# EAGLE design Temp_Project (EAGLE 9.6.2)

## Sheet 1 of 3: POWER SUPPLY
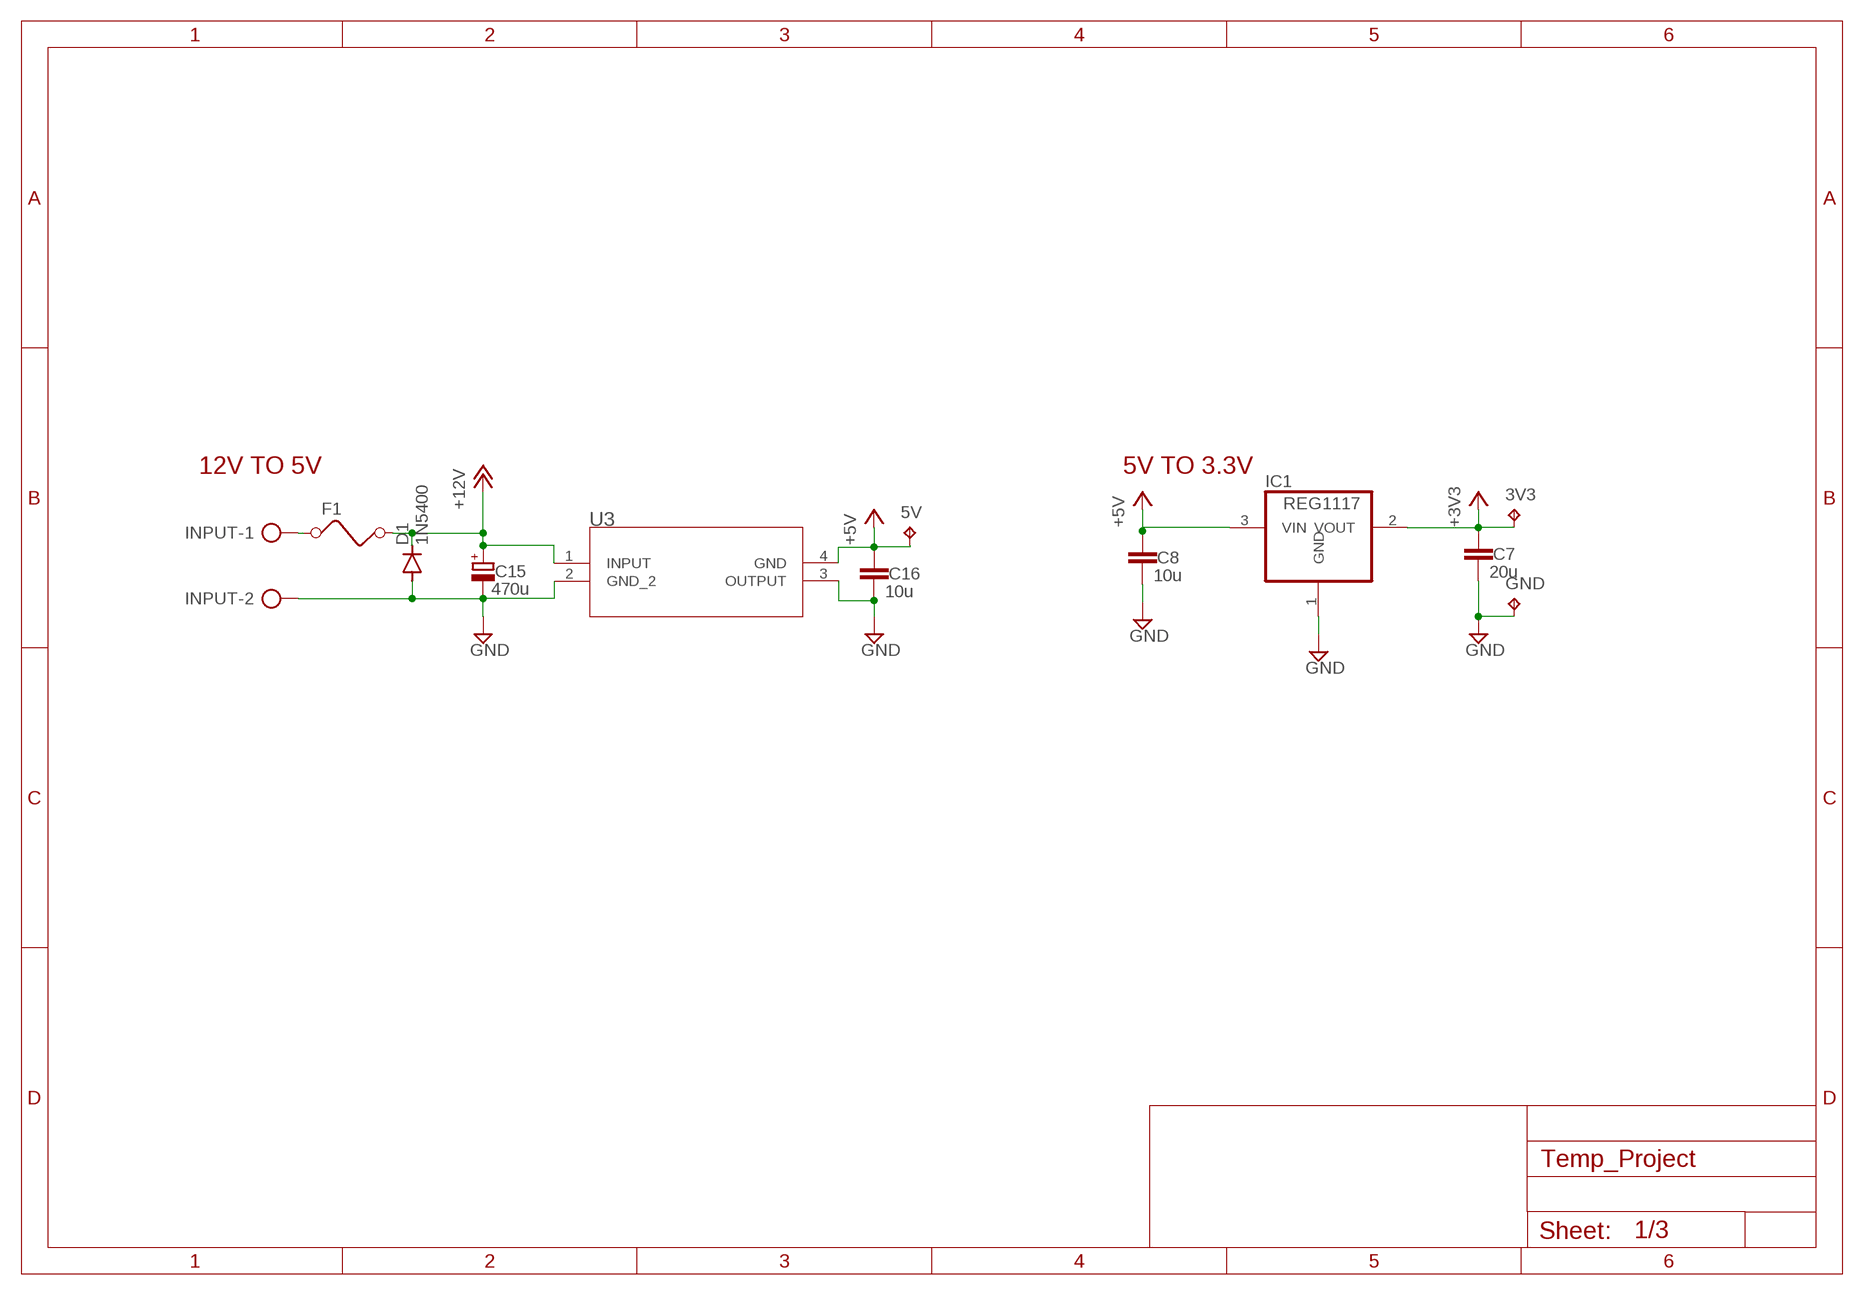
[diagram p0: schematic, sheet 1]

### Parts
3V3  TPPAD1-13  [P1-13]
5V  TPPAD1-13  [P1-13]
C7  20u  C-EUC0805  [C0805]
C8  10u  C-EUC0805  [C0805]
C15  470u  CPOL-EUE5-10.5  [E5-10,5]
C16  10u  C-EUC0805  [C0805]
D1  1N5400  [DO201-15]
F1  FUSE  [FUSE]
GND  TPPAD1-13  [P1-13]
IC1  REG1117  [SOT223]
INPUT  AK500/2-H  [AK500/2-H]
U3  LM7805MPX/NOPBDCY4_TEX  [DCY4_TEX]

### Nets
+3V3: 3V3.TP C7.1 IC1.2(VOUT) ; also sheet 2,3
+5V: 5V.TP C8.1 C16.1 IC1.3(VIN) U3.4(GND) ; also sheet 2
+12V: C15.+ D1.C F1.2 U3.1(INPUT) ; also sheet 2
GND: C7.2 C8.2 C15.- C16.2 D1.A GND.TP IC1.1(GND) INPUT.2 U3.2(GND_2) U3.3(OUTPUT) ; also sheet 2,3
N$3: F1.1 INPUT.1

### Notes on the sheet
- 12V TO 5V | 5V TO 3.3V

## Sheet 2 of 3: USER INTERFACE
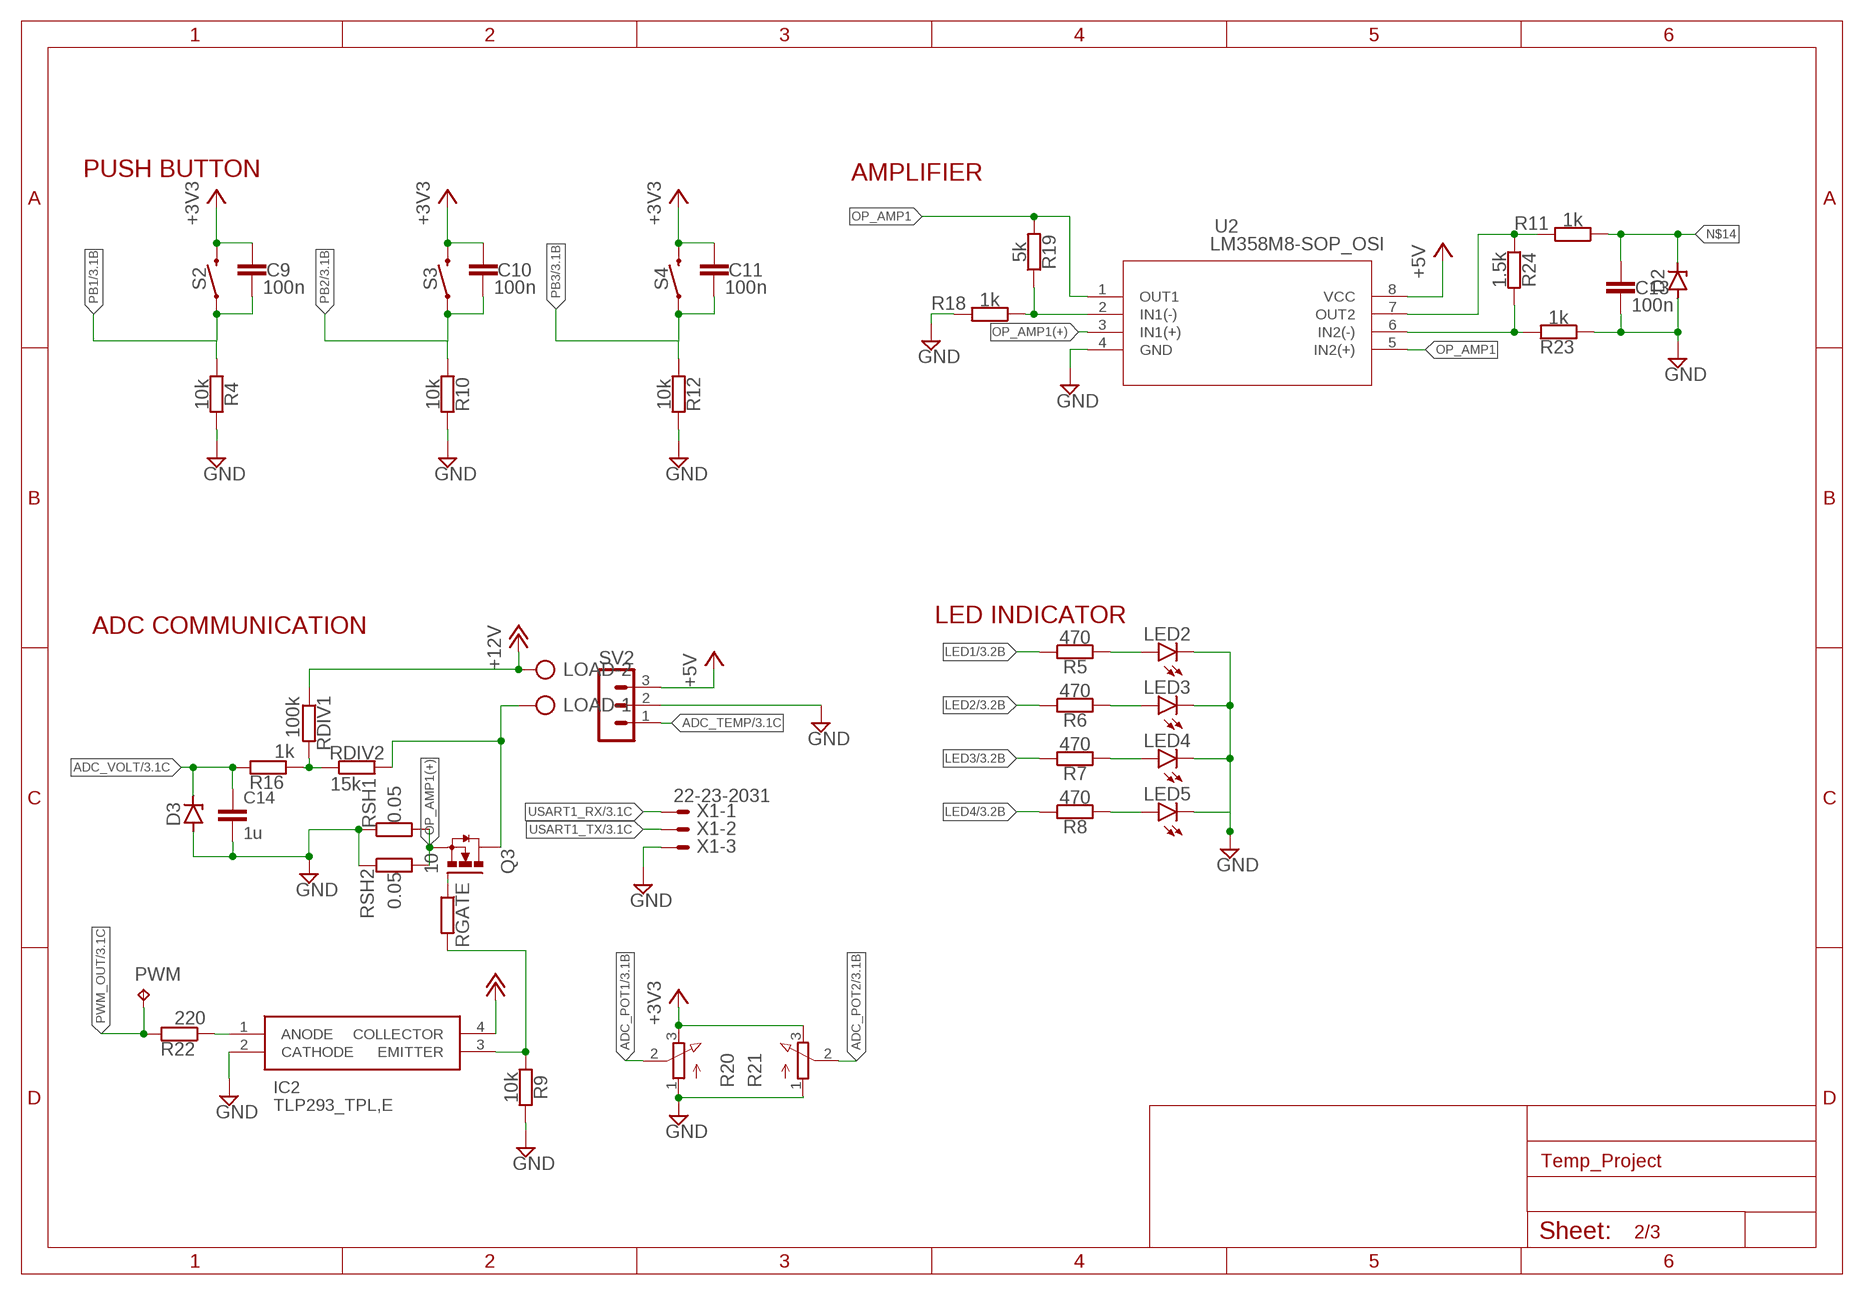
[diagram p1: schematic, sheet 2]

### Parts
C9  100n  C-EUC0805  [C0805]
C10  100n  C-EUC0805  [C0805]
C11  100n  C-EUC0805  [C0805]
C13  100n  C-EUC0805  [C0805]
C14  1u  C-EUC0805  [C0805]
D2  ZENER 3V3  ZENER-DIODESOD80C  [SOD80C]
D3  ZENER 3V3  ZENER-DIODESOD80C  [SOD80C]
IC2  TLP293_TPL,E  [SOIC127P700X220-4N]
LED2  LED3MM  [LED3MM]
LED3  LED3MM  [LED3MM]
LED4  LED3MM  [LED3MM]
LED5  LED3MM  [LED3MM]
LOAD  AK500/2-H  [AK500/2-H]
PWM  TPPAD1-13  [P1-13]
Q3  IRFZ44N  N-HEXFET-2D_SOT232-  [SOT223]
R4  10k  R-EU_R0805  [R0805]
R5  470  R-EU_R0805  [R0805]
R6  470  R-EU_R0805  [R0805]
R7  470  R-EU_R0805  [R0805]
R8  470  R-EU_R0805  [R0805]
R9  10k  R-EU_R0805  [R0805]
R10  10k  R-EU_R0805  [R0805]
R11  1k  R-EU_R0805  [R0805]
R12  10k  R-EU_R0805  [R0805]
R16  1k  R-EU_R0805  [R0805]
R18  1k  R-EU_R0805  [R0805]
R19  5k  R-EU_R0805  [R0805]
R20  3RP/1610N  [3RP/1610N]
R21  3RP/1610N  [3RP/1610N]
R22  220  R-EU_R0805  [R0805]
R23  1k  R-EU_R0805  [R0805]
R24  1.5k  R-EU_R0805  [R0805]
RDIV1  100k  R-EU_R0805  [R0805]
RDIV2  15k  R-EU_R0805  [R0805]
RGATE  10  R-EU_R0805  [R0805]
RSH1  0.05  R-EU_0617/22  [0617/22]
RSH2  0.05  R-EU_0617/22  [0617/22]
S2  MOMENTARY-SWITCH-SPST-SMD-6.0X3.5MM  [TACTILE_SWITCH_SMD_6.0X3.5MM]
S3  MOMENTARY-SWITCH-SPST-SMD-6.0X3.5MM  [TACTILE_SWITCH_SMD_6.0X3.5MM]
S4  MOMENTARY-SWITCH-SPST-SMD-6.0X3.5MM  [TACTILE_SWITCH_SMD_6.0X3.5MM]
SV2  MA03-1  [MA03-1]
U2  LM358M8-SOP_OSI  [8-SOP_OSI]
X1  22-23-2031  [22-23-2031]

### Nets
+3V3: C9.1 C10.1 C11.1 R20.3(E) R21.3(E) S2.2 S3.2 S4.2 ; also sheet 1,3
+5V: SV2.3 U2.8(VCC) ; also sheet 1
+12V: IC2.4(COLLECTOR) LOAD.2 RDIV1.1 ; also sheet 1
ADC_CUR: R11.2 R24.1 U2.7(OUT2) ; also sheet 3
ADC_POT1: R20.2(S) ; also sheet 3
ADC_POT2: R21.2(S) ; also sheet 3
ADC_TEMP: SV2.1 ; also sheet 3
ADC_VOLT: C14.1 D3.C R16.2 ; also sheet 3
GND: C13.2 C14.2 D2.A D3.A IC2.2(CATHODE) LED2.K(C) LED3.K(C) LED4.K(C) LED5.K(C) R4.1 R9.1 R10.1 R12.1 R18.2 R20.1(A) R21.1(A) R23.1 RSH1.1 RSH2.1 SV2.2 U2.4(GND) X1.3 ; also sheet 1,3
LED1: R5.1 ; also sheet 3
LED2: R6.1 ; also sheet 3
LED3: R7.1 ; also sheet 3
LED4: R8.1 ; also sheet 3
N$2: LED2.A R5.2
N$4: LED3.A R6.2
N$5: LED4.A R7.2
N$6: LED5.A R8.2
N$8: IC2.1(ANODE) R22.1
N$11: Q3.1(G) RGATE.1
N$12: LOAD.1 Q3.2(D) Q3.4(D) RDIV2.2
N$13: IC2.3(EMITTER) R9.2 RGATE.2
N$14: C13.1 D2.C R11.1
N$15: R18.1 R19.1 U2.2(IN1(-))
N$16: R16.1 RDIV1.2 RDIV2.1
N$17: R23.2 R24.2 U2.6(IN2(-))
OP_AMP1: R19.2 U2.1(OUT1) U2.5(IN2(+))
OP_AMP1(+): Q3.3(S) RSH1.2 RSH2.2 U2.3(IN1(+))
PB1: C9.2 R4.2 S2.1 ; also sheet 3
PB2: C10.2 R10.2 S3.1 ; also sheet 3
PB3: C11.2 R12.2 S4.1 ; also sheet 3
PWM_OUT: PWM.TP R22.2 ; also sheet 3
USART1_RX: X1.1 ; also sheet 3
USART1_TX: X1.2 ; also sheet 3

### Notes on the sheet
- PUSH BUTTON | AMPLIFIER
- LED INDICATOR
- ADC COMMUNICATION

## Sheet 3 of 3: MICROCONTROLLER
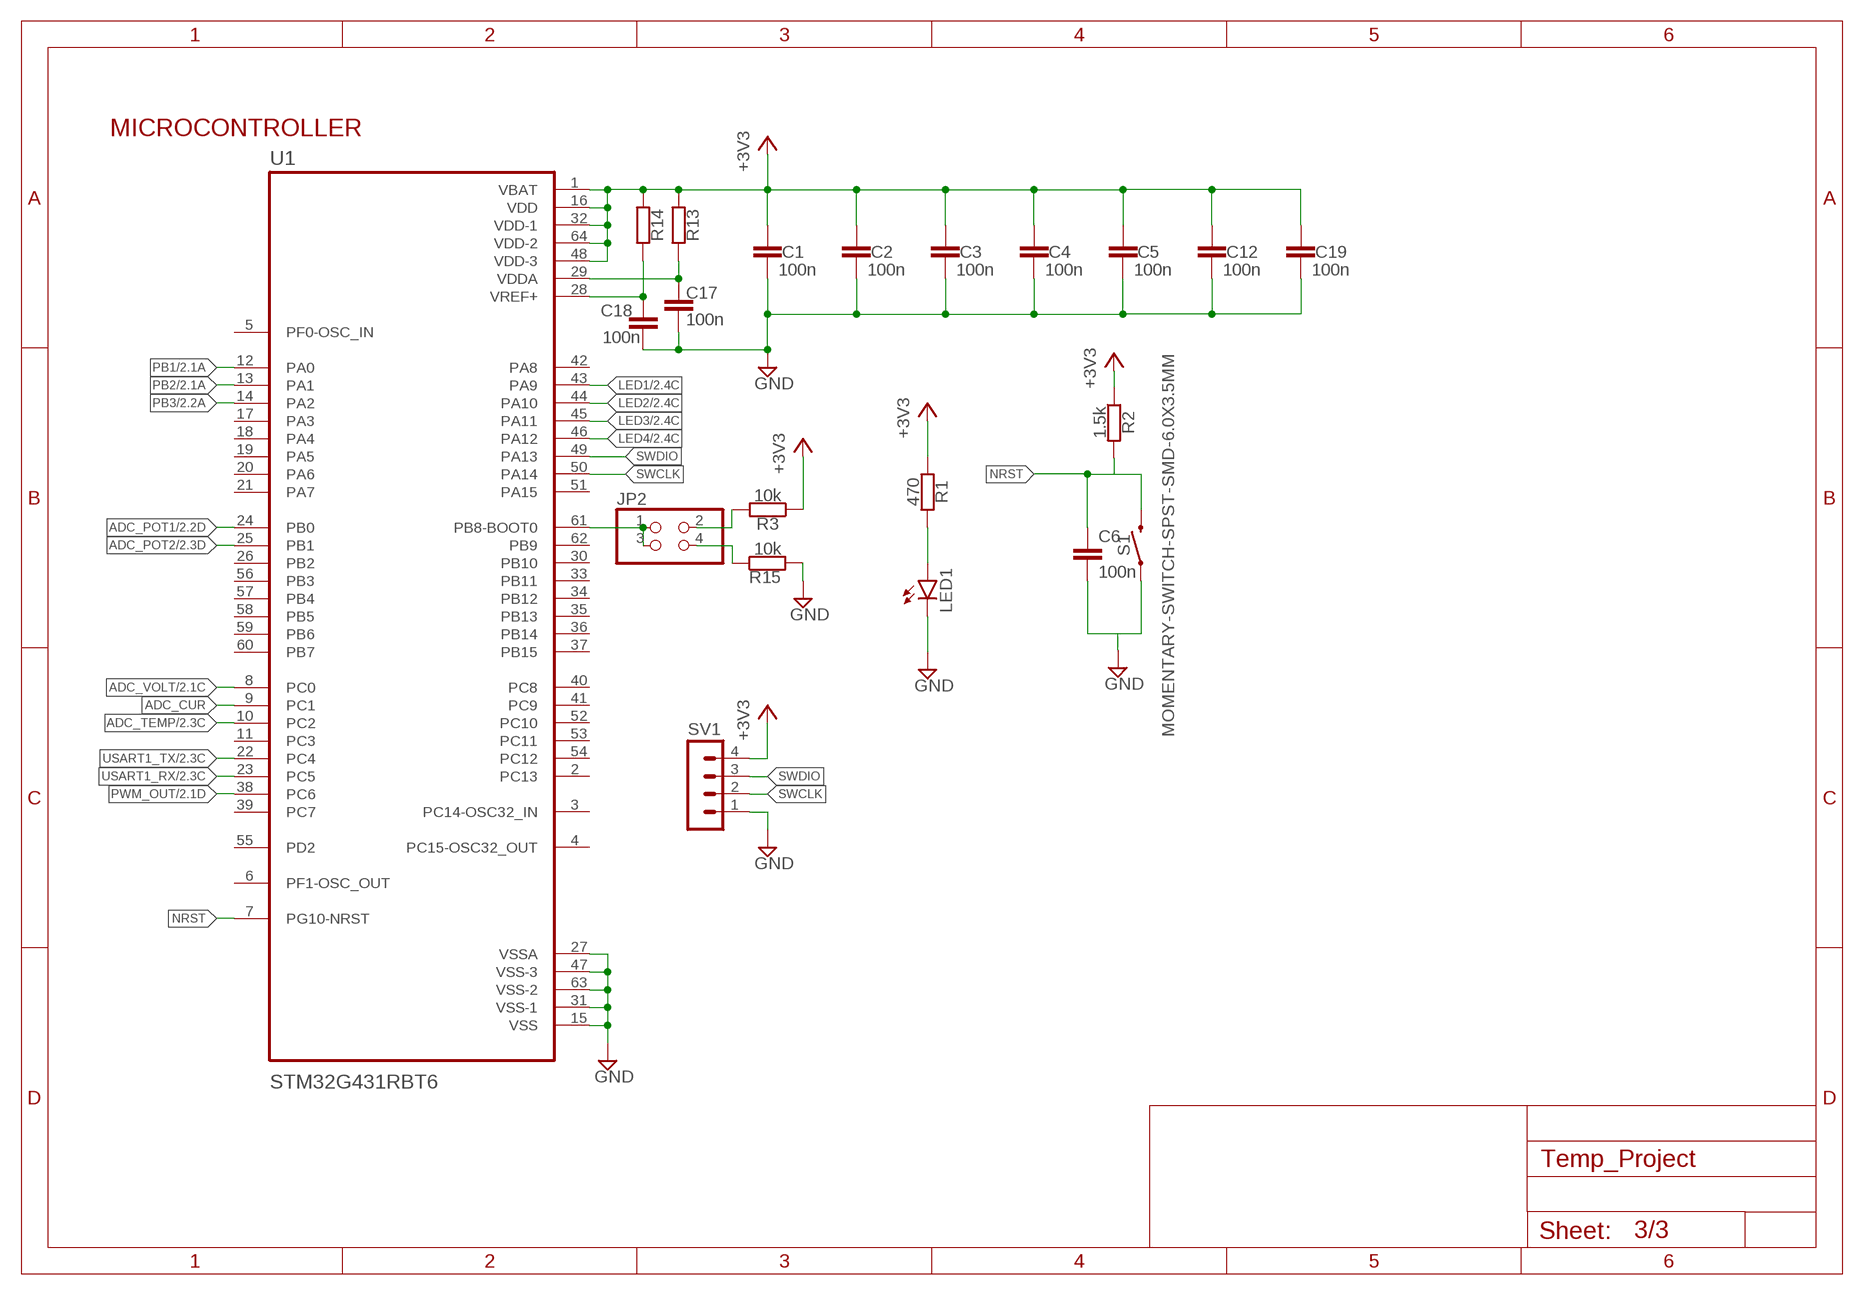
[diagram p2: schematic, sheet 3]

### Parts
C1  100n  C-EUC0805  [C0805]
C2  100n  C-EUC0805  [C0805]
C3  100n  C-EUC0805  [C0805]
C4  100n  C-EUC0805  [C0805]
C5  100n  C-EUC0805  [C0805]
C6  100n  C-EUC0805  [C0805]
C12  100n  C-EUC0805  [C0805]
C17  100n  C-EUC0805  [C0805]
C18  100n  C-EUC0805  [C0805]
C19  100n  C-EUC0805  [C0805]
JP2  PINHD-2X2  [2X02]
LED1  LEDCHIPLED_0805  [CHIPLED_0805]
R1  470  R-EU_R0805  [R0805]
R2  1.5k  R-EU_R0805  [R0805]
R3  10k  R-EU_R0805  [R0805]
R13  R-EU_R0603  [R0603]
R14  R-EU_R0603  [R0603]
R15  10k  R-EU_R0805  [R0805]
S1  MOMENTARY-SWITCH-SPST-SMD-6.0X3.5MM  [TACTILE_SWITCH_SMD_6.0X3.5MM]
SV1  MA04-1  [MA04-1]
U1  STM32G431RBT6  [QFP50P1200X1200X160-64N]

### Nets
+3V3: C1.1 C2.1 C3.1 C4.1 C5.1 C12.1 C19.1 R1.1 R2.1 R3.1 R13.2 R14.2 SV1.4 U1.1(VBAT) U1.16(VDD) U1.32(VDD-1) U1.48(VDD-3) U1.64(VDD-2) ; also sheet 1,2
ADC_CUR: U1.9(PC1) ; also sheet 2
ADC_POT1: U1.24(PB0) ; also sheet 2
ADC_POT2: U1.25(PB1) ; also sheet 2
ADC_TEMP: U1.10(PC2) ; also sheet 2
ADC_VOLT: U1.8(PC0) ; also sheet 2
GND: C1.2 C2.2 C3.2 C4.2 C5.2 C6.2 C12.2 C17.2 C18.2 C19.2 LED1.C R15.2 S1.1 SV1.1 U1.15(VSS) U1.27(VSSA) U1.31(VSS-1) U1.47(VSS-3) U1.63(VSS-2) ; also sheet 1,2
LED1: U1.43(PA9) ; also sheet 2
LED2: U1.44(PA10) ; also sheet 2
LED3: U1.45(PA11) ; also sheet 2
LED4: U1.46(PA12) ; also sheet 2
N$1: LED1.A R1.2
N$7: JP2.1 JP2.3 U1.61(PB8-BOOT0)
N$9: JP2.2 R3.2
N$10: JP2.4 R15.1
N$19: C17.1 R13.1 U1.29(VDDA)
N$20: C18.1 R14.1 U1.28(VREF+)
NRST: C6.1 R2.2 S1.2 U1.7(PG10-NRST)
PB1: U1.12(PA0) ; also sheet 2
PB2: U1.13(PA1) ; also sheet 2
PB3: U1.14(PA2) ; also sheet 2
PWM_OUT: U1.38(PC6) ; also sheet 2
SWCLK: SV1.2 U1.50(PA14)
SWDIO: SV1.3 U1.49(PA13)
USART1_RX: U1.23(PC5) ; also sheet 2
USART1_TX: U1.22(PC4) ; also sheet 2
Unconnected: U1.2(PC13) U1.3(PC14-OSC32_IN) U1.4(PC15-OSC32_OUT) U1.5(PF0-OSC_IN) U1.6(PF1-OSC_OUT) U1.11(PC3) U1.17(PA3) U1.18(PA4) U1.19(PA5) U1.20(PA6) U1.21(PA7) U1.26(PB2) U1.30(PB10) U1.33(PB11) U1.34(PB12) U1.35(PB13) U1.36(PB14) U1.37(PB15) U1.39(PC7) U1.40(PC8) U1.41(PC9) U1.42(PA8) U1.51(PA15) U1.52(PC10) U1.53(PC11) U1.54(PC12) U1.55(PD2) U1.56(PB3) U1.57(PB4) U1.58(PB5) U1.59(PB6) U1.60(PB7) U1.62(PB9)

### Notes on the sheet
- MICROCONTROLLER

## Library data of the parts
3V3 5V GND PWM = testpad:TP: Test pad
C1-C14 C16-C19 = rcl:C-EU: CAPACITOR, European symbol; SPICEPREFIX: C
C15 = rcl:CPOL-EU: POLARIZED CAPACITOR, European symbol; SPICEPREFIX: C
D1 = diode:1N5400: DIODE standard rectifier, 3 A, 50 V (Motorola)
D2 D3 = diode:ZENER-DIODE: Z-Diode
F1 = special:FUSE: FUSE 5 x 20 mm
IC1 = burr-brown:REG1117: 800mA and 1A Low Dropout (LDO) Positive Regulator 1.8V, 2.5V, 2.85V, 3.3V, 5V, and Adj; MPN: REG1117; OC_FARNELL: 1097566; OC_NEWARK: 14P6981
IC2 = TLP293_TPL_E:TLP293_TPL,E: Transistor Output Optocouplers 50mA Photocoupler 80V 3750Vrms Source: Datasheet <http://toshiba.semicon-storage.com/info/docget.jsp?did=14419&prodName=TLP293>; DESCRIPTION: Transistor Output Optocouplers 50mA Photocoupler 80V 3750Vrms; HEIGHT: 2.2mm; MANUFACTURER_NAME: Toshiba; MANUFACTURER_PART_NUMBER: TLP293(TPL,E; MOUSER_PART_NUMBER: 757-TLP293TPLE; MOUSER_PRICE-STOCK: https://www.mouser.co.uk/ProductDetail/Toshiba/TLP293TPLE?qs=OLJpxlzHOSTvU5p2rMEOZA%3D%3D
INPUT LOAD = con-ptr500:AK500/2-H: CONNECTOR Aug. 2004 / PTR Meßtechnik: Die Bezeichnung der Serie AK505 wurde geändert. Es handelt sich hierbei um AK500 in horizontaler Ausführung.; OC_FARNELL: unknown; OC_NEWARK: unknown
JP2 = pinhead:PINHD-2X2: PIN HEADER
LED1-LED5 = led:LED: LED OSRAM: - CHIPLED LG R971, LG N971, LY N971, LG Q971, LY Q971, LO R971, LY R971 LH N974, LH R974 LS Q976, LO Q976, LY Q976 LO Q996 - Hyper CHIPLED LW Q18S LB Q993, LB Q99A, LB R99A - SideLED LS A670, LO A670, LY A670, LG A670, LP A670 LB A673, LV A673, LT A673, LW A673 LH A674 LY A675 LS A676, LA A676, LO A676, LY A676, LW A676 LS A679, LY A679, LG A679 - Hyper Micro SIDELED® LS Y876, LA Y876, LO Y876, LY Y876 LT Y87S - SmartLED LW L88C, LW L88S LB L89C, LB L89S, LG L890 LS L89K, LO L89K, LY L89K LS L896, LA L896, LO L896, LY L896 - TOPLED LS T670, LO T670, LY T670, LG T670, LP T670 LSG T670, LSP T670, LSY T670, LOP T670, LYG T670 LG T671, LOG T671, LSG T671 LB T673, LV T673, LT T673, LW T673 LH T674 LS T676, LA T676, LO T676, LY T676, LB T676, LH T676, LSB T676, LW T676 LB T67C, LV T67C, LT T67C, LS T67K, LO T67K, LY T67K, LW E67C LS E67B, LA E67B, LO E67B, LY E67B, LB E67C, LV E67C, LT E67C LW T67C LS T679, LY T679, LG T679 LS T770, LO T770, LY T770, LG T770, LP T770 LB T773, LV T773, LT T773, LW T773 LH T774 LS E675, LA E675, LY E675, LS T675 LS T776, LA T776, LO T776, LY T776, LB T776 LHGB T686 LT T68C, LB T68C - Hyper Mini TOPLED® LB M676 - Mini TOPLED Santana® LG M470 LS M47K, LO M47K, LY M47K Source: http://www.osram.convergy.de LUXEON: - LUMILED® LXK2-PW12-R00, LXK2-PW12-S00, LXK2-PW14-U00, LXK2-PW14-V00 LXK2-PM12-R00, LXK2-PM12-S00, LXK2-PM14-U00 LXK2-PE12-Q00, LXK2-PE12-R00, LXK2-PE12-S00, LXK2-PE14-T00, LXK2-PE14-U00 LXK2-PB12-K00, LXK2-PB12-L00, LXK2-PB12-M00, LXK2-PB14-N00, LXK2-PB14-P00, LXK2-PB14-Q00 LXK2-PR12-L00, LXK2-PR12-M00, LXK2-PR14-Q00, LXK2-PR14-R00 LXK2-PD12-Q00, LXK2-PD12-R00, LXK2-PD12-S00 LXK2-PH12-R00, LXK2-PH12-S00 LXK2-PL12-P00, LXK2-PL12-Q00, LXK2-PL12-R00 Source: www.luxeon.com KINGBRIGHT: KA-3528ASYC Source: www.kingbright.com
Q3 = transistor-power:N-HEXFET-2D_?-*: HEXFET® Power MOSFET 2 Drain connects http://www.irf.com/product-info/datasheets/data/irll014n.pdf
R1-R16 R18 R19 R22-R24 RDIV1 RDIV2 RGATE RSH1 RSH2 = rcl:R-EU_: RESISTOR, European symbol; SPICEPREFIX: R
R20 R21 = pot:3RP/1610N: 16mm Potentiometer one level Source: http://www.alphapotentiometers.net/html/16mm_pot_2.html
S1-S4 = SparkFun-Switches:MOMENTARY-SWITCH-SPST: Momentary Switch (Pushbutton) - SPST Normally-open (NO) SPST momentary switches (buttons, pushbuttons). Variants PTH-12MM - 12mm square, through-hole Momentary Pushbutton Switch - 12mm Square <https://www.sparkfun.com/products/9190> (COM-09190) PTH-6.0MM, PTH-6.0MM-KIT - 6.0mm square, through-hole Mini Pushbutton Switch <https://www.sparkfun.com/products/97> (COM-00097) KIT package intended for soldering kit's - only one side of pads' copper is exposed. PTH-RIGHT-ANGLE-KIT - Right-angle, through-hole Right Angle Tactile Button <https://www.sparkfun.com/products/10791> - Used on SparkFun BigTime Watch Kit <https://www.sparkfun.com/products/11734> SMD-12MM - 12mm square, surface-mount Tactile Button - SMD (12mm) <https://www.sparkfun.com/products/12993> (COM-12993) Used on SparkFun PicoBoard <https://www.sparkfun.com/products/11888> SMD-4.5MM - 4.5mm Square Trackball Switch Used on SparkFun Blackberry Trackballer Breakout <https://www.sparkfun.com/products/13169> SMD-4.6MMX2.8MM - 4.60mm x 2.80mm, surface mount Used on SparkFun Pro Micro - RP2040 <https://www.sparkfun.com/products/17717> SMD-5.2MM, SMD-5.2-REDUNDANT - 5.2mm square, surface-mount Mini Pushbutton Switch - SMD <https://www.sparkfun.com/products/8720> (COM-08720) Used on Arduino Pro Mini <https://www.sparkfun.com/products/11114> REDUNDANT package connects both switch circuits together SMD-6.0X3.5MM - 6.0 x 3.5mm, surface mount Momentary Reset Switch SMD <https://www.sparkfun.com/products/8229> (COM-08229) SMD-6.2MM-TALL - 6.2mm square, surface mount Tactile Button - SMD (6mm) <https://www.sparkfun.com/products/12992> Used on SparkFun Digital Sandbox <https://www.sparkfun.com/products/12651> SMD-RIGHT-ANGLE - Right-angle, surface mount Used on SparkFun Block for Intel® Edison - Arduino <https://www.sparkfun.com/products/13036>; PROD_ID: SWCH-14278; SF_SKU: COM-08229
SV1 = con-lstb:MA04-1: PIN HEADER; OC_FARNELL: unknown; OC_NEWARK: unknown
SV2 = con-lstb:MA03-1: PIN HEADER; OC_FARNELL: unknown; OC_NEWARK: unknown
U1 = STM32G431RBT6:STM32G431RBT6: None; MANUFACTURER: STMicroelectronics; PACKAGE: QFP50P1200X1200X160-64N
U2 = 2024-10-28_07-08-54_Library:LM358M; COPYRIGHT: Copyright (C) 2024 Ultra Librarian. All rights reserved.; MANUFACTURER_PART_NUMBER: LM358M; MFR_NAME: onsemi / Fairchild Semiconductor
U3 = LM7805:LM7805MPX/NOPB; COPYRIGHT: Copyright (C) 2024 Ultra Librarian. All rights reserved.; MANUFACTURER_PART_NUMBER: LM7805MPX/NOPB; MFR_NAME: Texas Instruments
X1 = con-molex:22-23-2031: .100" (2.54mm) Center Header - 3 Pin; MF: MOLEX; MPN: 22-23-2031; OC_FARNELL: 1462950; OC_NEWARK: 30C0862

## Board
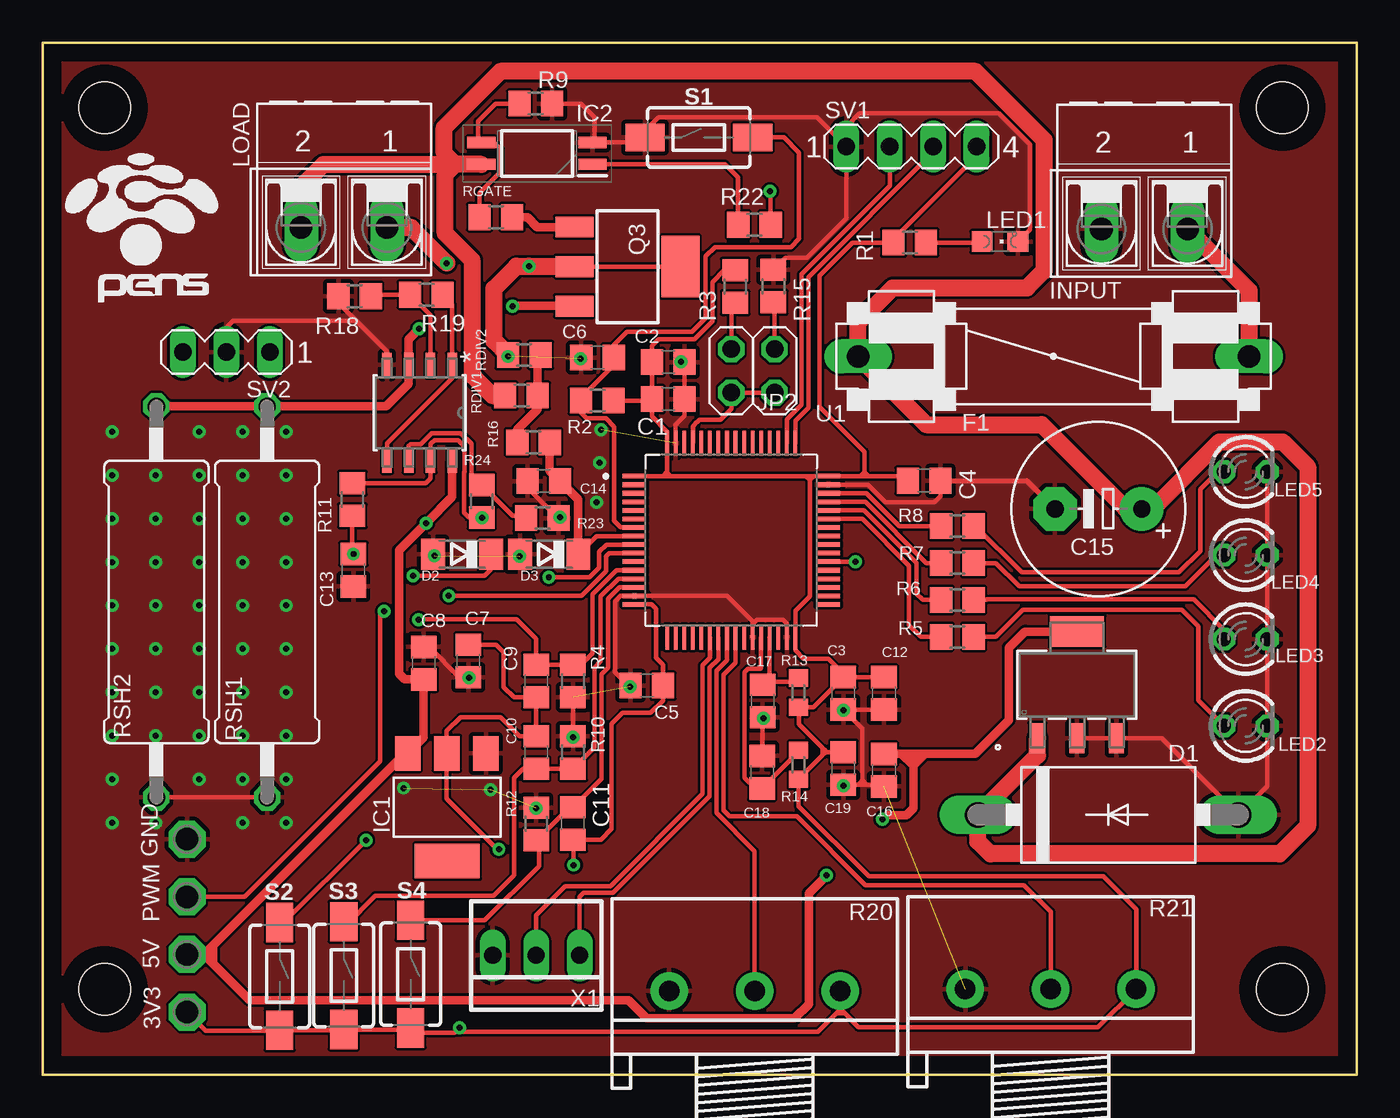
[diagram p3: board, top side]
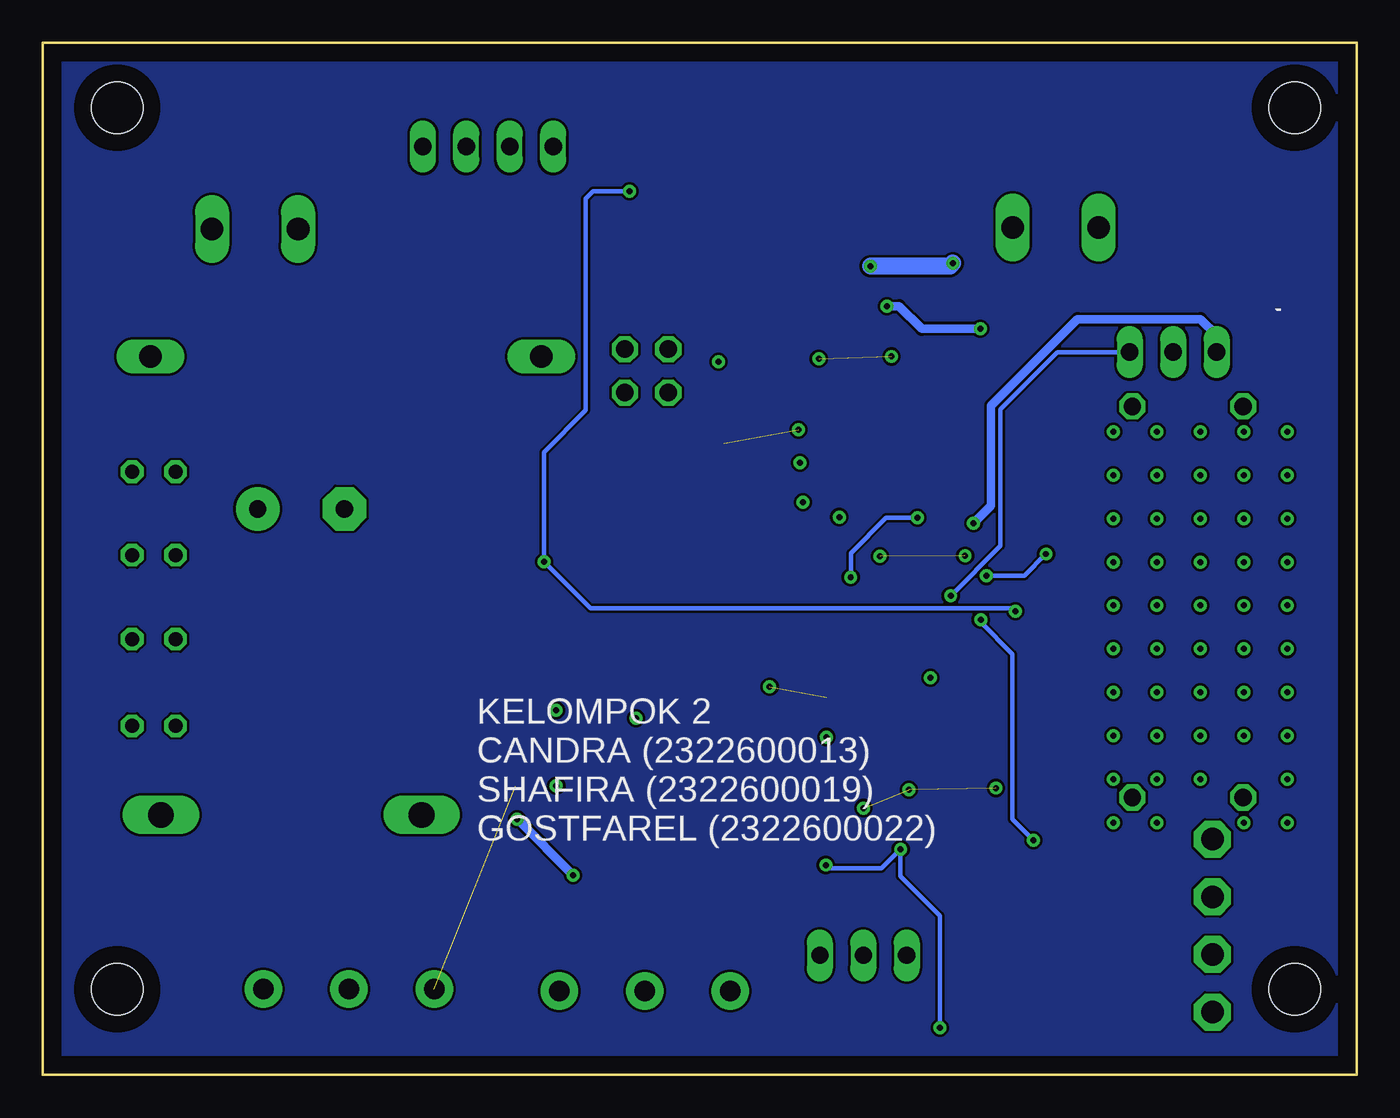
[diagram p4: board, bottom side, seen from below]

Size 76.83 x 60.33 mm. Coordinates in mm from the lower left corner, seen from the top.
Outline: 0,0 76.83,0 76.83,60.33 0,60.33 0,0
Copper layers (1*16): Top 0.035mm / dielectric 1.5mm / Bottom 0.035mm
Design rules "default *": minimum track width 6mil, minimum drill 0.35mm, track to track 6mil, track to pad 6mil, pad to pad 6mil, via to via 6mil, smd to smd 6mil, copper to edge 40mil, drill to drill 6mil, minimum pad ring 10mil, minimum via ring 8mil, stop-mask expansion 4mil, vias tented up to drill 35mil, thermal gap 10mil
Holes 3 mm at 3.62,56.53 3.62,5 72.49,5 72.49,56.53

### Footprints (pad centres in the part's own frame; a part is rotated, then mirrored left to right if it is on the bottom)
P1-13 = drill 1.321 pad 2.159 octagon: TP 0,0
C0805 = smd 1.3 x 1.5: 1 -0.95,0; 2 0.95,0
E5-10,5 = drill 1.016 pad 2.54: + -2.54,0 | drill 1.016 pad 2.54 octagon: - 2.54,0
DO201-15 = drill 1.499 long: A 7.62,0; C -7.62,0
SOD80C = smd 1.4 x 1.8: A 1.7,0; C -1.7,0
FUSE = drill 1.321 long: 1 -11.43,0; 2 11.43,0
SOT223 = smd 1.499 x 2.007: 1 -2.261,-3.15; 2 0.025,-3.15; 3 2.311,-3.15 | smd 3.81 x 2.007: 4 0,3.15
SOIC127P700X220-4N = smd 1.65 x 0.65: 1 -3.25,0.635; 2 -3.25,-0.635; 3 3.25,-0.635; 4 3.25,0.635
AK500/2-H = drill 1.321 long: 1 -2.515,0; 2 2.515,0
2X02 = drill 1.016 octagon: 1 -1.27,-1.27; 2 -1.27,1.27; 3 1.27,-1.27; 4 1.27,1.27
CHIPLED_0805 = smd 1.2 x 1.2: A 0,-1.05; C 0,1.05
LED3MM = drill 0.813 octagon: A -1.27,0; K 1.27,0
SOT223' = smd 1.219 x 2.235: 1 -2.311,-3.099; 2 0,-3.099; 3 2.311,-3.099 | smd 3.6 x 2.2: 4 0,3.099
R0805 = smd 1.3 x 1.5: 1 -0.95,0; 2 0.95,0
R0603 = smd 1 x 1.1: 1 -0.85,0; 2 0.85,0
3RP/1610N = drill 1.2 pad 2.184: 1 -5,0; 2 0,0; 3 5,0
0617/22 = drill 1.016 octagon: 1 -11.43,0; 2 11.43,0
TACTILE_SWITCH_SMD_6.0X3.5MM = smd 2.3 x 1.6: 1 -3.15,0; 2 3.15,0
MA04-1 = drill 1.016 long: 1 -3.81,0; 2 -1.27,0; 3 1.27,0; 4 3.81,0
MA03-1 = drill 1.016 long: 1 -2.54,0; 2 0,0; 3 2.54,0
QFP50P1200X1200X160-64N = smd 1.47 x 0.28: 1 -5.67,3.75; 2 -5.67,3.25; 3 -5.67,2.75; 4 -5.67,2.25; 5 -5.67,1.75; 6 -5.67,1.25; 7 -5.67,0.75; 8 -5.67,0.25; 9 -5.67,-0.25; 10 -5.67,-0.75; 11 -5.67,-1.25; 12 -5.67,-1.75; 13 -5.67,-2.25; 14 -5.67,-2.75; 15 -5.67,-3.25; 16 -5.67,-3.75; 33 5.67,-3.75; 34 5.67,-3.25; 35 5.67,-2.75; 36 5.67,-2.25; 37 5.67,-1.75; 38 5.67,-1.25; 39 5.67,-0.75; 40 5.67,-0.25; 41 5.67,0.25; 42 5.67,0.75; 43 5.67,1.25; 44 5.67,1.75; 45 5.67,2.25; 46 5.67,2.75; 47 5.67,3.25; 48 5.67,3.75 | smd 0.28 x 1.47: 17 -3.75,-5.67; 18 -3.25,-5.67; 19 -2.75,-5.67; 20 -2.25,-5.67; 21 -1.75,-5.67; 22 -1.25,-5.67; 23 -0.75,-5.67; 24 -0.25,-5.67; 25 0.25,-5.67; 26 0.75,-5.67; 27 1.25,-5.67; 28 1.75,-5.67; 29 2.25,-5.67; 30 2.75,-5.67; 31 3.25,-5.67; 32 3.75,-5.67; 49 3.75,5.67; 50 3.25,5.67; 51 2.75,5.67; 52 2.25,5.67; 53 1.75,5.67; 54 1.25,5.67; 55 0.75,5.67; 56 0.25,5.67; 57 -0.25,5.67; 58 -0.75,5.67; 59 -1.25,5.67; 60 -1.75,5.67; 61 -2.25,5.67; 62 -2.75,5.67; 63 -3.25,5.67; 64 -3.75,5.67
8-SOP_OSI = smd 1.422 x 0.559: 1 -2.794,1.905; 2 -2.794,0.635; 3 -2.794,-0.635; 4 -2.794,-1.905; 5 2.794,-1.905; 6 2.794,-0.635; 7 2.794,0.635; 8 2.794,1.905
DCY4_TEX = smd 0.889 x 1.765: 1 -2.311,-3.118; 2 0,-3.118; 3 2.311,-3.118 | smd 3.15 x 1.765: 4 0,3.118
22-23-2031 = drill 1 long: 1 -2.54,0; 2 0,0; 3 2.54,0

### Placement (x,y rotation side)
3V3  8.43,3.66 270 top
5V  8.43,7.03 270 top
C1  36.58,39.5 0 top
C2  36.58,41.66 0 top
C3  46.81,22.3 270 top
C4  51.54,34.73 0 top
C5  35.32,22.75 180 top
C6  32.44,41.92 180 top
C7  24.89,24.19 270 top
C8  22.28,24.06 90 top
C9  28.85,23.02 90 top
C10  28.85,18.84 270 top
C11  31,14.69 90 top
C12  49.19,22.3 270 top
C13  18.16,29.49 270 top
C14  29.29,34.7 180 top
C15  61.73,33.08 180 top
C16  49.19,17.81 270 top
C17  42.09,21.85 270 top
C18  42.06,17.69 90 top
C19  46.81,17.91 270 top
D1  62.3,15.19 0 top
D2  24.53,30.43 180 top
D3  29.61,30.43 180 top
F1  59.1,41.99 180 top
GND  8.43,13.77 270 top
IC1  23.65,15.64 180 top
IC2  28.9,53.86 180 top
INPUT  64.42,49.45 180 top
JP2  41.53,41.15 0 top
LED1  55.97,48.71 270 top
LED2  70.34,20.39 0 top
LED3  70.34,25.46 0 top
LED4  70.34,30.38 0 top
LED5  70.34,35.25 0 top
LOAD  17.62,49.52 180 top
PWM  8.43,10.4 270 top
Q3  IRFZ44N  [SOT223']  34.19,47.24 270 top
R1  50.7,48.65 0 top
R2  32.43,39.41 180 top
R3  40.5,46.07 270 top
R4  31,23.02 90 top
R5  53.48,25.59 0 top
R6  53.48,27.75 0 top
R7  53.48,29.91 0 top
R8  53.48,32.07 0 top
R9  28.83,56.77 180 top
R10  31,18.84 270 top
R11  18.1,33.63 90 top
R12  28.85,14.66 270 top
R13  44.18,22.34 270 top
R14  44.2,18.12 270 top
R15  42.72,46.1 90 top
R16  28.7,36.97 0 top
R18  18.24,45.51 180 top
R19  22.43,45.6 0 top
R20  41.63,4.9 0 top
R21  58.94,5.01 0 top
R22  41.61,49.69 0 top
R23  29.22,32.54 180 top
R24  25.67,33.53 90 top
RDIV1  27.99,39.7 0 top
RDIV2  28.16,42.07 180 top
RGATE  26.5,50.13 180 top
RSH1  13.12,27.64 90 top
RSH2  6.64,27.64 90 top
S1  38.36,54.79 0 top
S2  13.86,5.75 270 top
S3  17.6,5.8 270 top
S4  21.51,5.88 270 top
SV1  50.8,54.25 0 top
SV2  10.73,42.24 180 top
U1  40.26,31.24 0 top
U2  22.04,38.7 270 top
U3  60.47,22.79 0 top
X1  28.86,6.98 180 top

### Tracks (layer width: path | path; a pad name or v marks a point on that pad's centre or on a via)
+3V3  (via drill 0.35)
  Top 0.25: 36.48,34.99 36.26,34.99 | 36.26,34.99 U1.1 | 36.51,35.24 U1.64 36.51,37.6 35.63,38.48 C1.1 | C1.1 C2.1 35.63,42.61 36.01,42.99 38.1,42.99 39.16,44.05 39.16,46.33 39.85,47.02 R3.1 | C3.1 46.81,23.45 45.93,24.33 44.48,24.33 44.01,24.8 U1.32 44.01,27.13 44.85,27.97 44.85,34.77 | C3.1 45.06,21.49 R13.2 44.22,21.46 44.22,20.49 45.6,19.11 | 45.86,18.86 45.72,18.99 | 45.86,18.86 45.79,18.86 45.72,18.79 | 45.86,18.86 C19.1 | 45.6,18.66 R14.2 44.2,15.7 48.31,11.59 62.03,11.59 63.94,9.68 R21.3 61.71,2.78 47.7,2.78 46.89,3.59 | 45.6,18.66 45.72,18.79 | 47.81,34.99 U1.48 45.07,34.99 | 47.81,34.99 48.05,34.99 | 48.05,34.99 48.29,34.99 | 48.29,34.99 50.32,34.99 C4.1 | C3.1 C12.1 | SV1.4 54.61,53.69 49.75,48.83 R1.1 47.35,48.65 45.41,46.71 45.41,39.06 48.05,36.42 48.05,35.23 | C11.1 31.05,13.74 | 31.05,13.74 32.63,13.74 33.26,14.37 33.26,20.52 33.89,21.15 35.55,21.15 36.27,21.88 C5.1 36.27,23.96 35.85,24.38 35.85,27.25 35.61,27.49 U1.16 | 48.05,34.99 48.05,35.23 | 3V3.TP 9.52,2.58 13.84,2.58 S2.2 17.56,2.6 S3.2 21.43,2.65 | 48.05,35.23 48.29,34.99 | 48.05,35.23 47.81,34.99 | v26.67,13.19 26.61,13.14 23.62,16.13 23.63,16.14 IC1.2 23.63,20.1 24.43,20.9 26.77,20.9 27.88,19.8 C10.1 C9.1 27.55,22.07 26.96,22.66 26.96,24.69 26.51,25.14 C7.1 | v31.05,12.26 31.05,13.74 | 45.07,34.99 44.85,34.77 | 44.85,34.77 44.63,34.99 | 44.63,34.99 36.72,34.99 | 36.72,34.99 36.48,34.99 | 36.51,35.2 36.51,35.02 36.48,34.99 | 36.26,34.99 36.51,35.24 | 36.51,35.24 36.51,35.2 | 36.51,35.2 36.72,34.99 | 44.63,34.99 45.07,34.99 | 21.43,2.65 S4.2 21.78,2.46 | 46.4,3.59 45.32,2.5 24.62,2.5 v24.37,2.75 v24.37,2.74 24.09,2.46 21.78,2.46
  Top 0.25: 46.4,3.59 46.63,3.81 46.63,3.85 | 46.89,3.59 46.63,3.85 | 46.63,3.85 R20.3 | 21.78,2.46 21.61,2.46 21.43,2.65 | 46.4,3.59 46.89,3.59 | 45.72,18.79 45.72,18.99 | 45.72,18.99 45.6,19.11 | 45.6,19.11 45.6,18.66 | R2.1 35.54,39.41 C1.1
  Bottom 0.25: v31.05,12.26 30.86,12.07 27.79,12.07 v26.67,13.19 26.67,11.6 24.37,9.3 v24.37,2.75
+5V  (via drill 0.35)
  Top 0.5: v45.82,11.67 45.82,11.63 44.8,10.61 44.8,4.13 43.96,3.29 35.31,3.29 34.24,4.36 12.1,4.36 9.96,6.5 | v49.1,14.93 49.35,15.18 50.5,15.18 50.9,15.58 50.9,18.08 | 50.9,18.08 50.23,18.76 C16.1 51.05,18.76 | 51.05,18.76 51.57,18.76 | 51.57,18.76 54.53,18.76 56.49,20.71 56.49,24.96 57.44,25.91 U3.4 | U2.8 23.94,33.78 v22.4,32.24 20.83,30.67 20.83,23.45 21.17,23.11 C8.1 22.28,19.73 IC1.3 21.19,18.79 9.96,7.56 | 5V.TP 9.43,7.03 | 9.43,7.03 9.96,7.56 | 9.96,6.5 9.43,7.03 | 9.96,7.56 9.96,6.5 | 50.9,18.08 51.57,18.76 | 50.9,18.08 50.9,18.6 51.05,18.76
  Bottom 0.5: v45.82,11.67 49.08,14.93 v49.1,14.93 | v22.4,32.24 21.38,33.26 21.38,39.12 16.33,44.16 9.14,44.16 8.19,43.22 SV2.3
+12V
  Top 1: IC2.4 24.12,53.22 | 24.12,53.22 23.47,53.87 23.47,55.36 26.76,58.66 54.55,58.66 58.55,54.65 58.55,46.99 57.55,45.99 49.71,45.99 47.67,43.95 F1.2 51.66,38 58.41,38 63.33,33.08 C15.+ 64.9,33.08 68.81,36.99 72.51,36.99 73.97,35.53 73.97,14.55 72.33,12.91 55.41,12.91 54.68,13.64 D1.C 54.69,15.19 58.16,18.67 U3.1 | 24.12,53.22 23.54,52.65 23.54,49.18 25.1,47.62 25.1,40.89 26.29,39.7 RDIV1.1 | LOAD.2 15.1,51.91 16.41,53.22 24.12,53.22
ADC_CUR  (via drill 0.35)
  Top 0.25: U1.9 32.96,30.99 32.52,30.56 32.52,29.64 31.96,29.08 v29.59,29.08 | v25.7,32.55 R24.1 24.91,32.58 24.64,32.85 24.64,35.24 24.66,35.26 24.66,36.72 24.28,37.1 22.9,37.1 22.67,36.88 U2.7 22.67,34.87 22.39,34.58 R11.2
  Bottom 0.25: v29.59,29.08 29.59,30.48 27.52,32.55 v25.7,32.55
ADC_POT1
  Top 0.25: U1.24 40.01,24.23 39.4,23.62 39.4,15.3 41.63,13.07 R20.2
ADC_POT2
  Top 0.25: U1.25 40.51,24.08 39.8,23.37 39.8,15.47 40.17,15.1 44.1,15.1 48.11,11.09 57.37,11.09 58.94,9.52 R21.2
ADC_TEMP  (via drill 0.35)
  Top 0.25: U1.10 33.1,30.49 32.92,30.32 32.92,29.43 31.51,28.01 v23.74,28.01
  Bottom 0.25: v23.74,28.01 20.84,30.91 20.84,38.91 17.51,42.24 SV2.1
ADC_VOLT
  Top 0.25: D3.C 32.38,31.49 U1.8
  Top 0.5: D3.C 31.32,33.63 C14.1 29.65,35.3 R16.2
GND  (via drill 0.35)  (7 unrouted)
  Top 0.25: C17.2 42.09,18.67 C18.2 | C12.2 C3.2 47.93,20.23 47.93,17.2 | C19.2 47.72,16.95 | 47.72,16.95 47.93,16.95 | 47.93,16.95 48.18,16.95 | 48.18,16.95 49.09,16.95 C16.2 | 47.93,16.95 47.93,17.2 | 47.93,17.2 48.18,16.95 | 47.93,17.2 47.72,16.99 47.72,16.95 | R4.1 R10.1 | U1.31 43.51,26.35 43.28,26.58 41.76,26.58 41.59,26.42 | U1.27 41.51,26.33 41.59,26.42 | v34.33,22.67 33.46,23.54 33.46,27.66 33.8,27.99 U1.15 40.02,27.99 41.59,26.42 | U1.63 37.01,37.99 37.53,38.51 C1.2 C2.2 | U1.47 48.26,34.49 49.29,33.46 52.14,33.46 52.49,33.81 C4.2 | U3.2 U3.3 65.44,19.67 D1.A 71.61,16.88 LED2.K LED3.K LED4.K LED5.K | U2.4 20.13,42.26 18.32,44.08 | R9.1 31.49,56.77 32.28,55.98 32.28,54.62 IC2.2 32.17,54.51 34.93,54.51 S1.1 35.21,55.18 36,55.96 45.28,55.96 SV1.1 | R15.2 43.43,47.76 44.69,47.76 46.99,50.06 SV1.1 | C8.2 22.59,25.01 24.36,23.24 C7.2 | LED1.C 57.71,49.4 57.71,54.39 55.91,56.19 47.76,56.19 46.99,55.42 SV1.1 | SV2.2 10.73,43.68 11.14,44.08 18.32,44.08 | RSH1.1 RSH2.1 | 18.32,44.08 17.29,45.1 R18.2 | C14.2 28.34,34.32 30.12,32.54 R23.1
  Top 0.305: C4.2 57.54,34.73 C15.-
  other vias: 32.55,35.77 32.64,37.71 32.38,33.47 30.26,32.6 27.88,30.3 28.85,15.59 22.9,30.34 46.82,21.3 24.93,23.2 26.18,16.66 21.1,16.76 31,19.74 46.81,16.9 37.33,41.67 42.14,20.84 27.2,41.99 4.06,37.59 9.14,37.59 11.68,37.59 14.22,37.59 6.6,37.59 4.06,35.05 9.14,35.05 11.68,35.05 14.22,35.05 6.6,35.05 4.06,32.51 9.14,32.51 11.68,32.51 14.22,32.51 6.6,32.51 4.06,29.97 9.14,29.97 11.68,29.97 14.22,29.97 6.6,29.97 4.06,27.43 9.14,27.43 11.68,27.43 14.22,27.43 6.6,27.43 4.06,24.89 9.14,24.89 11.68,24.89 14.22,24.89 6.6,24.89 4.06,22.35 9.14,22.35 11.68,22.35 14.22,22.35 6.6,22.35 4.06,19.81 9.14,19.81 11.68,19.81 14.22,19.81 6.6,19.81 4.06,17.27 9.14,17.27 11.68,17.27 14.22,17.27 4.06,14.73 11.68,14.73 14.22,14.73 6.6,14.73 31.46,41.85
  pour Top: 0,0 76.83,0 76.83,4.45 76.83,60.33 0,60.33
GND1
  pour Bottom: 0,0 76.83,0 76.83,4.45 76.83,60.33 0,60.33
LED1
  Top 0.25: U1.43 47.92,32.49 50.66,29.75 50.66,26.29 50.65,26.28 51.34,25.59 R5.1
LED2
  Top 0.25: U1.44 48.03,32.99 51.1,29.92 51.1,28.13 51.47,27.75 R6.1
LED3
  Top 0.25: U1.45 48.1,33.49 51.68,29.91 R7.1
LED4
  Top 0.25: R8.1 50.09,32.07 48.17,33.99 U1.46
N$1
  Top 0.25: LED1.A 54.89,48.65 R1.2
N$2
  Top 0.25: R5.2 55.74,25.59 57.32,27.17 66.62,27.17 67.57,26.22 67.57,21.89 LED2.A
N$3
  Top 1: INPUT.1 70.53,45.85 F1.1
N$4
  Top 0.25: R6.2 54.46,27.78 55.21,27.78 55.22,27.78 67.3,27.78 69.07,26.02 LED3.A
N$5
  Top 0.25: R7.2 55.74,29.91 57.1,28.55 66.8,28.55 68.62,30.38 LED4.A
N$6
  Top 0.25: R8.2 54.55,32.07 57.26,29.36 66.43,29.36 67.68,30.61 67.68,34.23 68.7,35.25 LED5.A
N$7
  Top 0.25: JP2.3 JP2.1 40.26,38.93 39.62,38.29 38.39,38.29 38.25,38.15 38.24,38.15 38.01,37.92 U1.61
N$8
  Top 0.25: R22.1 40.66,52.47 39.91,53.22 IC2.1
N$9
  Top 0.25: JP2.2 40.26,44.88 R3.2
N$10
  Top 0.25: R15.1 42.8,44.89 JP2.4
N$11
  Top 0.5: Q3.1 28.92,49.55 28.34,50.13 RGATE.1
N$12  (via drill 0.35)
  Top 0.25: Q3.2 Q3.4
  Top 1: v23.62,47.44 21.54,49.52 LOAD.1 | Q3.2 31.06,47.27 v28.43,47.27 27.7,47.27 26.38,45.95 26.38,42.9 RDIV2.2
  Bottom 1: v28.43,47.27 23.79,47.27 v23.62,47.44
N$13
  Top 0.25: R9.2 26.49,56.77 25.45,55.73 25.45,54.69 IC2.3 26.39,54.49 26.75,54.13 26.75,52.76 25.55,51.55 RGATE.2
N$14  (via drill 0.35)
  Top 0.25: R11.1 18.1,30.5 C13.1 | D2.C 26.23,29.54 25.84,29.16 v21.66,29.16
  Bottom 0.25: v21.66,29.16 19.45,29.16 C13.1
  other vias: 18.16,30.44
N$15
  Top 0.25: U2.2 22.67,44.41 R19.1 19.28,45.6 R18.1
N$16
  Top 0.5: RDIV2.1 28.94,41.91 RDIV1.2 28.94,38.9 27.75,37.7 R16.1
N$17
  Top 0.25: U2.6 21.4,36.76 21.5,36.85 22.08,36.85 22.73,37.5 24.45,37.5 25.06,36.89 25.06,35.09 R24.2 27.46,32.69 28.12,32.69 R23.2
N$19
  Top 0.25: U1.29 42.51,23.21 C17.1 42.26,22.97 43.96,22.97 R13.1
N$20
  Top 0.25: U1.28 42.01,23.78 41.96,23.73 41.23,23.73 41.04,23.53 41.04,17.37 41.67,16.74 C18.1 44.2,18.87 R14.1
NRST
  Top 0.25: U1.7 33.8,31.99 33.42,32.37 33.42,37.89 32.94,38.37 31.8,38.37 31.45,38.72 31.45,39.38 R2.2 31.48,39.58 33.38,41.48 C6.1 33.38,42.65 34.17,43.43 37.97,43.43 38.76,44.22 38.76,47.84 39.3,48.38 43.74,48.38 44.22,48.86 44.22,53.9 43.33,54.79 S1.2
OP_AMP1
  Top 0.25: U2.5 20.13,36.91 23.94,40.72 U2.1 23.94,45.03 R19.2
OP_AMP1(+)  (via drill 0.35)
  Top 0.5: RSH2.2 RSH1.2 20.09,39.07 21.4,40.38 U2.3 21.4,42.99 v22.02,43.6 | v27.48,44.93 27.45,44.96 31.06,44.96 Q3.3
  Bottom 0.5: v22.02,43.6 25.44,43.6 26.76,44.93 v27.48,44.93
PB1  (via drill 0.35)
  Top 0.25: v21.99,26.6 22.01,26.62 27.72,26.62 28.85,25.49 C9.2 R4.2 31.48,23.97 32.16,24.64 32.16,28.09 33.56,29.49 U1.12 | S2.1 14.09,8.9 v18.9,13.71
  Bottom 0.25: v21.99,26.6 21.99,26.44 20.13,24.58 20.13,14.94 v18.9,13.71
PB2
  Top 0.25: U1.13 33.66,28.99 32.63,27.96 32.63,24.16 32.26,23.79 32.26,19.15 R10.2 C10.2 28.07,17.89 27.55,17.37 27.55,11.65 26.37,10.47 19.45,10.47 17.76,8.78 S3.1
PB3
  Top 0.25: U1.14 33.73,28.49 33.06,27.82 33.06,23.8 32.66,23.4 32.66,17.3 C11.2 30.8,15.64 28.87,13.71 29.02,13.71 29.02,12.2 25.85,9.03 S4.1
  Top 0.5: R12.2 28.87,13.71
PWM_OUT  (via drill 0.35)
  Top 0.25: U1.38 47.41,29.99 47.42,30 47.52,30 v47.53,29.99 | R22.2 42.56,51.61 v42.53,51.64 | PWM.TP 11.82,10.4 19.74,18.32 19.74,26.87 v19.96,27.09
  Bottom 0.25: v42.53,51.64 44.66,51.64 45.09,51.21 45.09,38.84 47.53,36.4 v47.53,29.99 44.8,27.26 20.12,27.26 v19.96,27.09
SWCLK
  Top 0.25: U1.50 43.51,38.31 44.36,39.16 44.36,46.79 49.53,51.96 SV1.2
SWDIO
  Top 0.25: SV1.3 52.08,54.24 52.08,53.95 44.76,46.62 44.76,38.99 44.01,38.24 U1.49
USART1_RX
  Top 0.25: U1.23 39.51,24.3 38.99,23.79 38.99,16.27 33.36,10.63 31.62,10.63 31.39,10.41 X1.1
USART1_TX
  Top 0.25: U1.22 39.01,24.37 38.59,23.95 38.59,16.43 33.19,11.03 30.55,11.03 28.86,9.34 X1.2

### Text on the board
bNames: KELOMPOK 2 / CANDRA (2322600013) / SHAFIRA (2322600019) / GOSTFAREL (2322600022)